# EasyEDA Pro project Source_Boat-Board.epro, schematic pi
Board Name: PCB13; Create Date: 2026-05-29; Page Name: P1; Project Name: fallout; Schematic Name: pi; Update Date: 2026-06-06; Company: EasyEDA.com; Page Size: A4; Version: V1.0
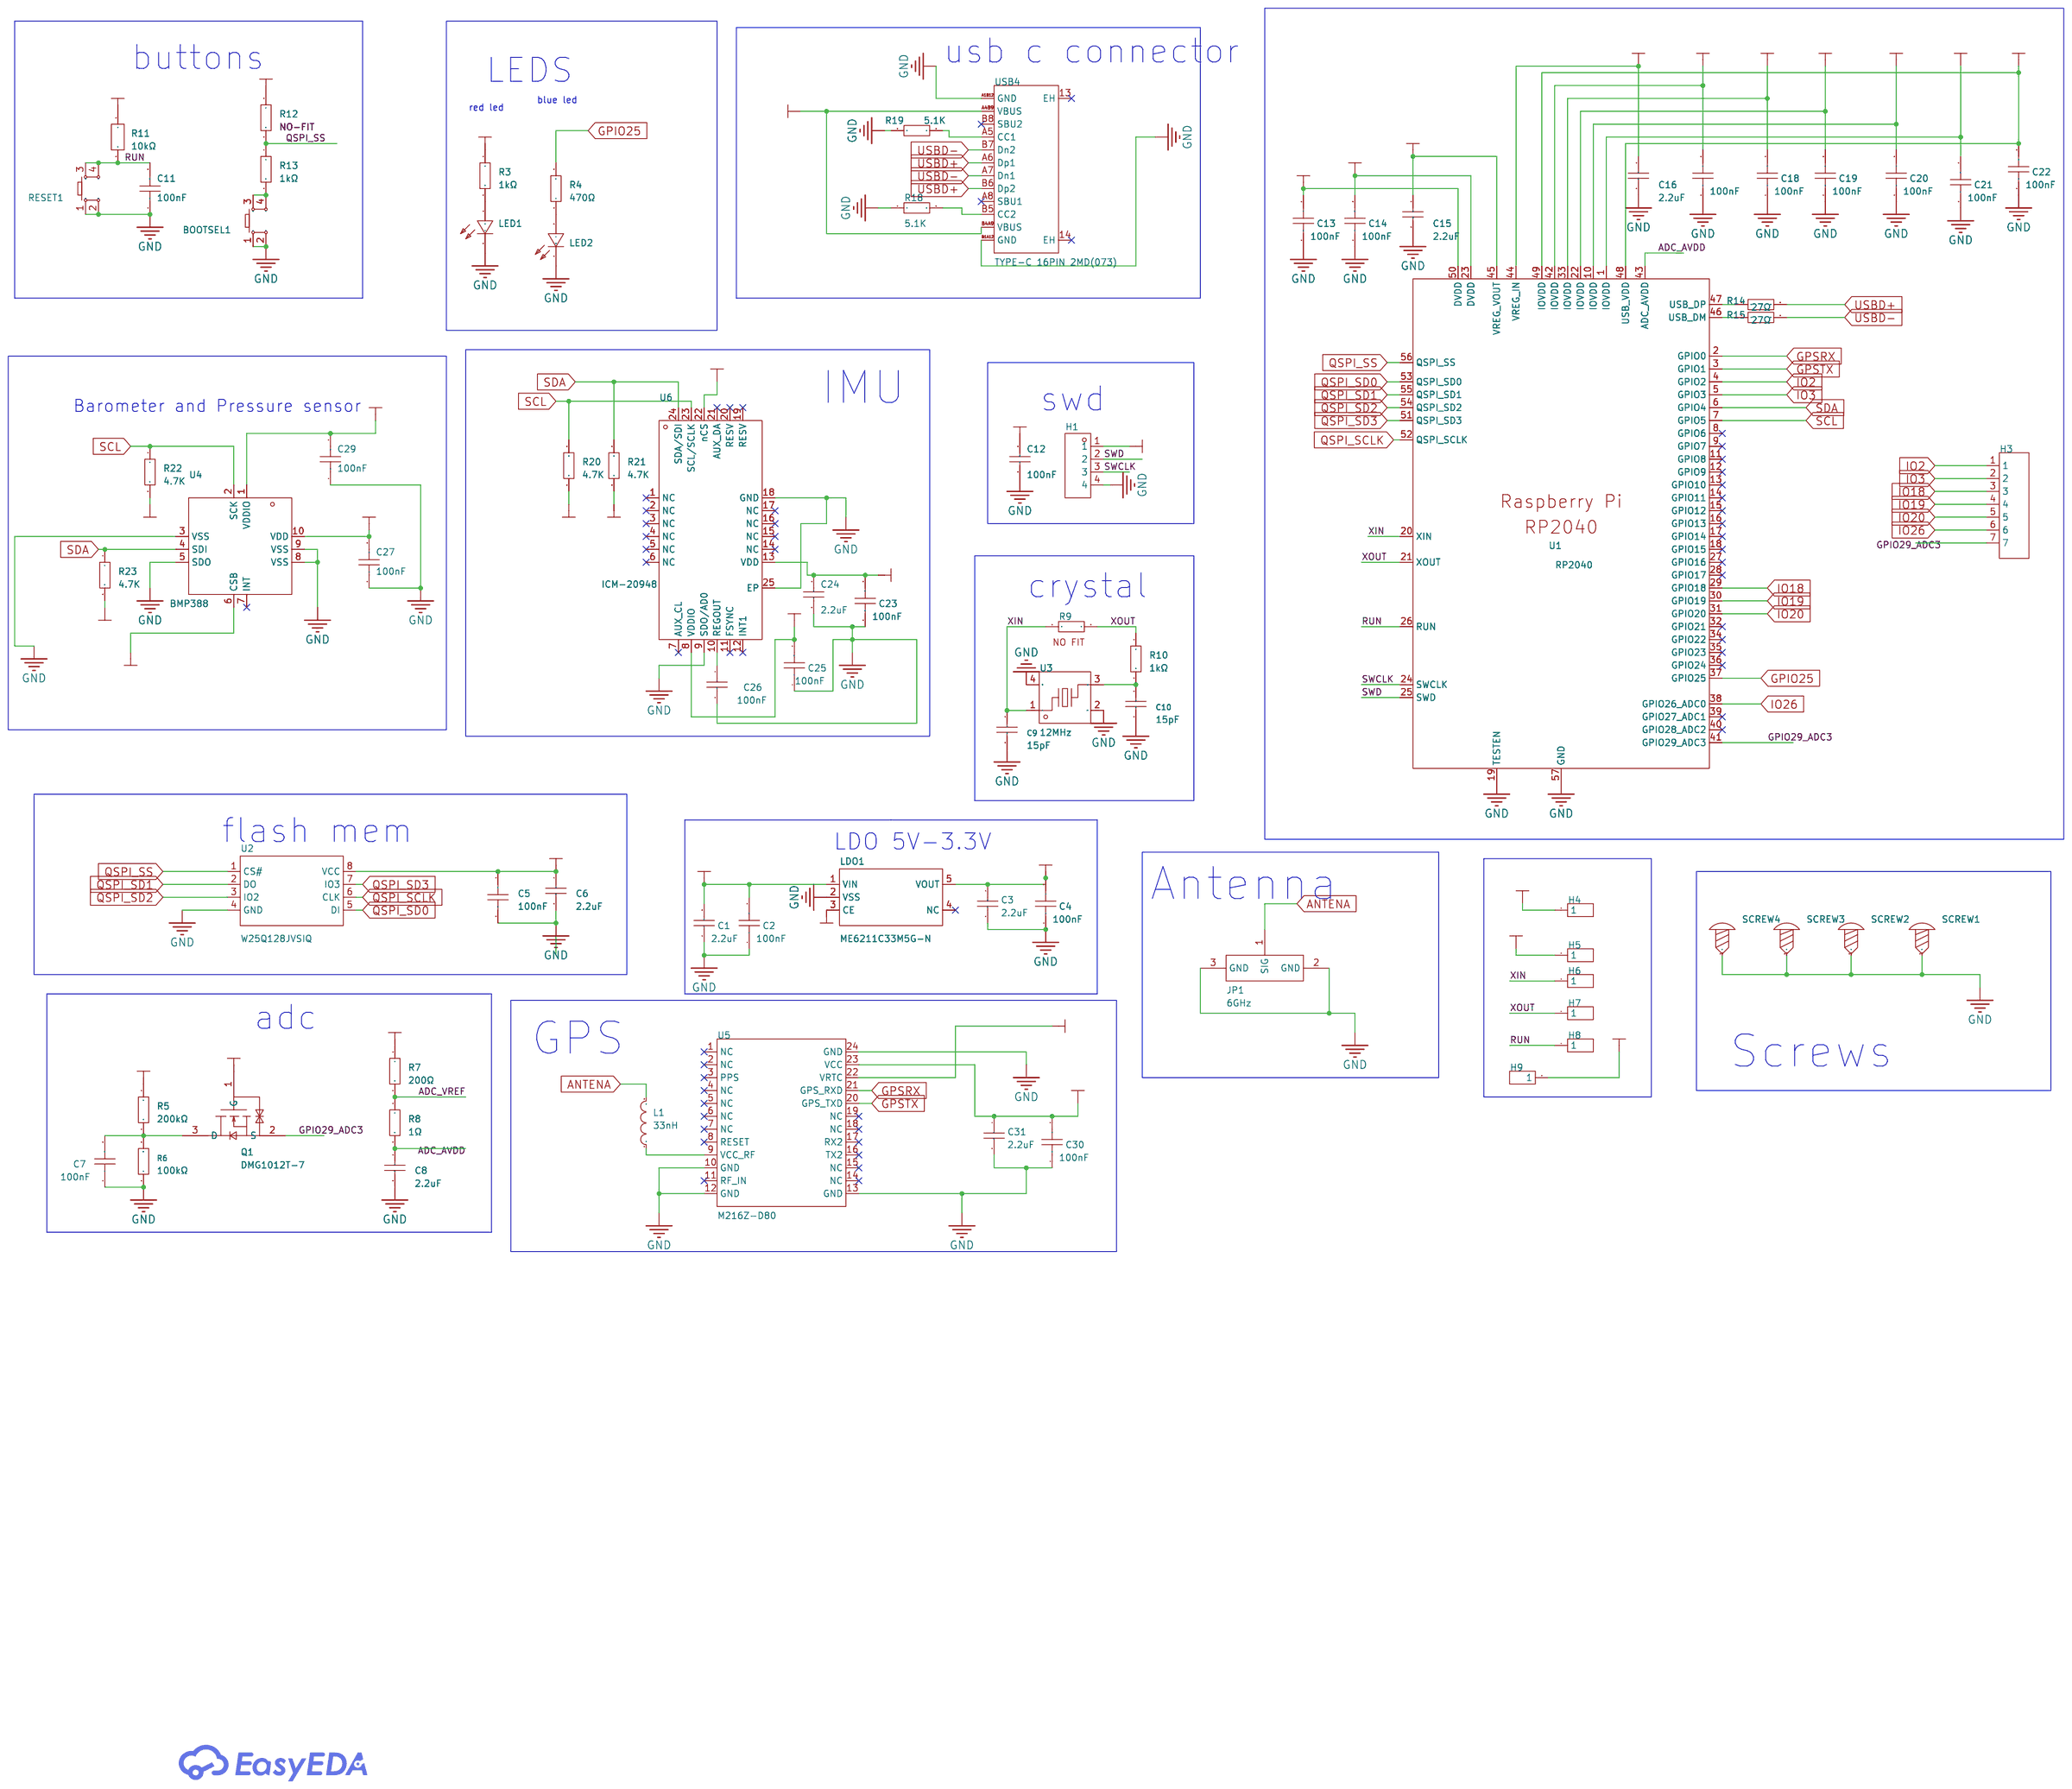
[diagram p0: schematic sheet]

## Parts
BOOTSEL1  PTS815SJK250SMTRLFS  [SW-SMD_4P-L4.2-W3.3-P2.15-LS5.1]
C1  2.2uF  [C0603]
C2  100nF  [C0603]
C3  2.2uF  [C0603]
C4  100nF  [C0603]
C5  100nF  [C0603]
C6  2.2uF  [C0603]
C7  100nF  [C0603]
C8  2.2uF  [C0603]
C9  15pF  [C0603]
C10  15pF  [C0603]
C11  100nF  [C0603]
C12  100nF  [C0603]
C13  100nF  [C0603]
C14  100nF  [C0603]
C15  2.2uF  [C0603]
C16  2.2uF  [C0603]
C17  100nF  [C0603]
C18  100nF  [C0603]
C19  100nF  [C0603]
C20  100nF  [C0603]
C21  100nF  [C0603]
C22  100nF  [C0603]
C23  100nF  [C0603]
C24  2.2uF  [C0603]
C25  100nF  [C0603]
C26  100nF  [C0603]
C27  100nF  [C0603]
C29  100nF  [C0603]
C30  100nF  [C0603]
C31  2.2uF  [C0603]
H1  DZ254W-11-04-65  [HDR-TH_4P-P2.54-H-M-W10.3]
H3  -  [HDR-TH_7P-P2.54-V-F]
H4  -  [HDR-TH_1P-V-M_XKB_X4611WV-01I-C28D40]
H5  -  [HDR-TH_1P-V-M_XKB_X4611WV-01I-C28D40]
H6  -  [HDR-TH_1P-V-M_XKB_X4611WV-01I-C28D40]
H7  -  [HDR-TH_1P-V-M_XKB_X4611WV-01I-C28D40]
H8  -  [HDR-TH_1P-V-M_XKB_X4611WV-01I-C28D40]
H9  -  [HDR-TH_1P-V-M_XKB_X4611WV-01I-C28D40]
JP1  6GHz  [RF-SMD_FRF05002-JSS103M]
L1  33nH  [L0603]
LDO1  ME6211C33M5G-N  [SOT-23-5_L3.0-W1.7-P0.95-LS2.8-BL]
LED1  NCD0603R1  [LED0603-RD_RED]
LED2  19-217/BHC-ZL1M2RY/3T  [LED0603-FD_BLUE]
Q1  DMG1012T-7  [SOT-523-3_L1.6-W0.8-P1.00-LS1.6-BR]
R3  1kΩ  [R0603]
R4  470Ω  [R0603]
R5  200kΩ  [R0603]
R6  100kΩ  [R0603]
R7  200Ω  [R0603]
R8  1Ω  [R0603]
R9  NO FIT  [R0603]
R10  1kΩ  [R0603]
R11  10kΩ  [R0603]
R12  NO-FIT  [R0603]
R13  1kΩ  [R0603]
R14  27Ω  [R0603]
R15  27Ω  [R0603]
R18  5.1K  [R0603]
R19  5.1K  [R0603]
R20  4.7K  [R0603]
R21  4.7K  [R0603]
R22  4.7K  [R0603]
R23  4.7K  [R0603]
RESET1  PTS815SJK250SMTRLFS  [SW-SMD_4P-L4.2-W3.3-P2.15-LS5.1]
SCREW1  -  [Screw-Hole-M2]
SCREW2  -  [Screw-Hole-M2]
SCREW3  -  [Screw-Hole-M2]
SCREW4  -  [Screw-Hole-M2]
U1  RP2040  [LQFN-56_L7.0-W7.0-P0.4-EP]
U2  W25Q128JVSIQ  [SOIC-8_L5.3-W5.3-P1.27-LS8.0-BL]
U3  12MHz  [CRYSTAL-SMD_4P-L3.2-W2.5-BL]
U4  BMP388  [SENSORM-SMD_BMP388]
U5  M216Z-D80  [LCC-24_L16.3-W12.2_NEO-NEO-M10]
U6  ICM-20948  [QFN-24_L3.0-W3.0-P0.40-BL-EP]
USB4  TYPE-C 16PIN 2MD(073)  [USB-C-SMD_TYPE-C-16PIN-2MD-073]

## Library data of the parts
BOOTSEL1 RESET1 = PTS815SJK250SMTRLFS: 操作寿命10万次，使用温度-20°C 至 70°C,尺寸4.20mmx3.20mmx2.50mm，操作力度2.5N; LCSC Part Name: 轻触开关; Supplier Part: C918859; Manufacturer: C&K; Supplier Footprint: SMD; JLCPCB Part Class: 扩展库; Datasheet: https://atta.szlcsc.com/upload/public/pdf/source/20190916/C411883_4F77F16E1D8E48DC707D8949CEE7CF80.pdf; Supplier: LCSC
C1 C3 C6 C8 C15 C16 C24 C31 = CL10A225KO8NNNC: Capacitance:2.2uF Tolerance:±10% Tolerance:±10% Voltage Rating:16V Temperature Coefficient:X5R; LCSC Part Name: 2.2uF ±10% 16V; Supplier Part: C23630; Manufacturer: SAMSUNG(三星); Supplier Footprint: 0603; JLCPCB Part Class: Basic Part; Datasheet: https://item.szlcsc.com/datasheet/CL10A225KO8NNNC/24366.html; Supplier: LCSC; Tolerance: ±10%; Voltage Rating: 16V; Temperature Coefficient: X5R
C2 C4 C11 C13 C14 C17-C23 C25 C27 C29 C30 = 0603B104K500AT: Capacitance:100nF Tolerance:±10% Tolerance:±10% Voltage Rating:50V Temperature Coefficient:X7R; LCSC Part Name: 100nF ±10% 50V; Supplier Part: C191538; Manufacturer: FH(风华); Supplier Footprint: 0603; Datasheet: https://item.szlcsc.com/datasheet/0603B104K500AT/216930.html; Supplier: LCSC; Tolerance: ±10%; Voltage Rating: 50V; Temperature Coefficient: X7R
C5 C7 = CC0603KRX7R9BB104: Capacitance:100nF Tolerance:±10% Tolerance:±10% Voltage Rating:50V Temperature Coefficient:X7R; LCSC Part Name: 100nF ±10% 50V; Supplier Part: C14663; Manufacturer: YAGEO(国巨); Supplier Footprint: 0603; JLCPCB Part Class: Basic Part; Datasheet: https://item.szlcsc.com/datasheet/CC0603KRX7R9BB104/15331.html; Supplier: LCSC; Tolerance: ±10%; Voltage Rating: 50V; Temperature Coefficient: X7R
C9 C10 = CC0603JRNPO9BN150: Capacitance:15pF Tolerance:±5% Tolerance:±5% Voltage Rating:50V Temperature Coefficient:NP0; LCSC Part Name: 15pF ±5% 50V; Supplier Part: C107037; Manufacturer: YAGEO(国巨); Supplier Footprint: 0603; Datasheet: https://item.szlcsc.com/datasheet/CC0603JRNPO9BN150/108253.html; Supplier: LCSC; Tolerance: ±5%; Voltage Rating: 50V; Temperature Coefficient: NP0
C12 C26 = 0603B104K500NT_C30926: Capacitance:100nF Tolerance:±10% Tolerance:±10% Voltage Rating:50V Temperature Coefficient:X7R; LCSC Part Name: 100nF ±10% 50V; Supplier Part: C30926; Manufacturer: FH(风华); Manufacturer Part: 0603B104K500NT; Supplier Footprint: 0603; Datasheet: https://item.szlcsc.com/datasheet/0603B104K500NT/31683.html; Supplier: LCSC; Tolerance: ±10%; Voltage Rating: 50V; Temperature Coefficient: X7R
H1 = DZ254W-11-04-65: 间距:2.54mm;总PIN位数:4;排数:1;插针结构:1x4P;行距:-;安装类型:弯插;圆针/方针:方针;额定电流:3A;额定电压:-;配合针长度:6mm;塑高:2.54mm;端接针长度:-;工作温度范围:-;颜色:-;; LCSC Part Name: 2.54mm 1x4P 弯插 方针; Supplier Part: C2935929; Manufacturer: DEALON(德艺隆); Supplier Footprint: 弯插,P=2.54mm; JLCPCB Part Class: 扩展库; Datasheet: https://atta.szlcsc.com/upload/public/pdf/source/20211231/CEC96EEC99F3217E207F74B399519373.pdf; Supplier: LCSC; Pitch: 2.54mm; Number of Pins: 4; Number of Rows: 1; Pin Structure: 1x4P; Mounting Type: 弯插; Circluar Pins/Square Pins: 方针; Current Rating (Max): 3A; Length of Mating Pin: 6mm; Insulation Height: 2.54mm
H3 = HDR-F_2.54_1x7P: Supplier Footprint: Through
H4-H9 = HDR-M_2.54_1x1P: Supplier Footprint: Through
JP1 = U.FL-R-SMT-1(80)_C88374: Connector Type:Board Side Interface:Male Pin Number of Ports:1 Interface Diameter:2mm Interface Length/Height:1.25mm Frequency:6GHz RF Series:IPEX Impedance:50Ω Style:- Operating Temperature Range:-40℃~+90℃ Operating Temperature Range:-40℃~+90℃; LCSC Part Name: IPEX 内针; Supplier Part: C88374; Manufacturer: HRS(广濑); Manufacturer Part: U.FL-R-SMT-1(80); Supplier Footprint: SMD; JLCPCB Part Class: Extended Part; Datasheet: https://item.szlcsc.com/datasheet/U.FL-R-SMT-1(80)/89553.html; Supplier: LCSC; Connector Type: Board Side; Interface: Male Pin; Number of Ports: 1; Interface Diameter: 2mm; Interface Length/Height: 1.25mm; RF Series: IPEX; Impedance: 50Ω; Operating Temperature Range: -40℃~+90℃
L1 = L_0603
LDO1 = ME6211C33M5G-N: Output Type:Fixed Voltage - Supply:6V Output Voltage:3.3V Output Voltage:3.3V Output Current:500mA Power Supply Rejection Ratio (PSRR):70dB@(1kHz) Voltage Dropout:120mV@(100mA) standby current:60uA Noise:50uVrms Features:Over Current Protection；Enable；Sho; LCSC Part Name: 输入6V 输出3.3V 500mA; Supplier Part: C82942; Manufacturer: MICRONE(南京微盟); Supplier Footprint: SOT-23-5; Datasheet: https://item.szlcsc.com/datasheet/ME6211C33M5G-N/84106.html; Supplier: LCSC; Output Type: Fixed; Voltage - Supply: 6V; Output Voltage: 3.3V; Output Current: 500mA; Power Supply Rejection Ratio (PSRR): 70dB@(1kHz); Voltage Dropout: 120mV@(100mA); standby current: 60uA; Noise: 50uVrms; Features: Over Current Protection；Enable；Short Circuit Protection; Operating Temperature: -40℃~+150℃; Output Configuration: Positive; Number of Outputs: 1
LED1 = NCD0603R1_C84263: Lamp Holder Type:- Illumination Color:Red Voltage - Forward(Vf):1.6V~2.6V Voltage - Forward(Vf):1.6V~2.6V Power(Watts):65mW Forward Current:25mA Wavelength - Dominant:615nm~630nm Wavelength - Dominant:615nm~630nm Peak Wavelength:630nm Diode Configuration:; LCSC Part Name: 片式发光二极管; Supplier Part: C84263; Manufacturer: 国星光电; Supplier Footprint: 0603; JLCPCB Part Class: Extended Part; Datasheet: https://item.szlcsc.com/datasheet/NCD0603R1/85432.html; Supplier: LCSC; Illumination Color: Red; Voltage - Forward(Vf): 1.6V~2.6V; Power(Watts): 65mW; Forward Current: 25mA; Wavelength - Dominant: 615nm~630nm; Peak Wavelength: 630nm; Diode Configuration: Discrete Diode; Luminous Intensity: 220mcd; Viewing Angle: 130°; Operating Temperature: -30℃~+85℃
LED2 = 19-217/BHC-ZL1M2RY/3T: Lamp Holder Type:- Illumination Color:Blue Voltage - Forward(Vf):2.8V Voltage - Forward(Vf):2.8V Power(Watts):110mW Forward Current:5mA Wavelength - Dominant:465nm~475nm Wavelength - Dominant:465nm~475nm Peak Wavelength:468nm Diode Configuration:Discrete; LCSC Part Name: 蓝灯 停产; Supplier Part: C72041; Manufacturer: EVERLIGHT(亿光); Supplier Footprint: 0603; JLCPCB Part Class: Extended Part; Datasheet: https://en.everlight.com/wp-content/plugins/ItemRelationship/product_files/pdf/19-217-BHC-ZL1M2RY-3T.pdf; Supplier: LCSC; Illumination Color: Blue; Voltage - Forward(Vf): 2.8V; Power(Watts): 110mW; Forward Current: 5mA; Wavelength - Dominant: 465nm~475nm; Peak Wavelength: 468nm; Diode Configuration: Discrete Diode; Lens Color: Water Clear; Luminous Intensity: 24.5mcd~28.5mcd; Viewing Angle: 120°; Operating Temperature: -40℃~+85℃
Q1 = DMG1012T-7: Number:1 N-Channel Drain to Source Voltage:20V Current - Continuous Drain(Id):630mA RDS(on):300mΩ@4.5V；400mΩ@2.5V；500mΩ@1.8V Pd - Power Dissipation:280mW Gate Threshold Voltage (Vgs(th)):1V@250uA Gate Charge(Qg):736.6pC@4.5V Input Capacitance(Ciss):60.67p; LCSC Part Name: 1个N沟道 耐压:20V 电流:630mA; Supplier Part: C20512; Manufacturer: DIODES(美台); Supplier Footprint: SOT-523; JLCPCB Part Class: Extended Part; Datasheet: https://item.szlcsc.com/datasheet/DMG1012T-7/21223.html; Supplier: LCSC; Number: 1 N-Channel; Drain to Source Voltage: 20V; Current - Continuous Drain(Id): 630mA; RDS(on): 300mΩ@4.5V；400mΩ@2.5V；500mΩ@1.8V; Pd - Power Dissipation: 280mW; Gate Threshold Voltage (Vgs(th)): 1V@250uA; Gate Charge(Qg): 736.6pC@4.5V; Input Capacitance(Ciss): 60.67pF; Reverse Transfer Capacitance (Crss@Vds): 5.37pF; Operating Temperature: -55℃~+150℃; Output Capacitance(Coss): 9.68pF
R3 R10 R13 = RC0603FR-071KL: Type:Thick Film Resistor Resistance:1kΩ Tolerance:±1% Tolerance:±1% Power(Watts):100mW Voltage-Supply(Max):75V Temperature Coefficient:±100ppm/℃ Temperature Coefficient:±100ppm/℃ Operating Temperature:-55℃~+155℃ Operating Temperature:-55℃~+155℃; LCSC Part Name: 厚膜电阻 1kΩ ±1% 100mW; Supplier Part: C22548; Manufacturer: YAGEO(国巨); Supplier Footprint: 0603; JLCPCB Part Class: Extended Part; Datasheet: https://item.szlcsc.com/datasheet/RC0603FR-071KL/23274.html; Supplier: LCSC; Type: Thick Film Resistor; Tolerance: ±1%; Power(Watts): 100mW; Voltage-Supply(Max): 75V; Temperature Coefficient: ±100ppm/℃; Operating Temperature: -55℃~+155℃
R4 = RC0603FR-07470RL: Type:Thick Film Resistors Resistance: Tolerance:±1% Tolerance:±1% Power(Watts): Overload Voltage (Max): Temperature Coefficient:±100ppm/℃ Temperature Coefficient:±100ppm/℃ Operating Temperature Range:-55℃~+155℃ Operating Temperature Range:-55℃~+155℃; LCSC Part Name: 厚膜电阻 470Ω ±1% 100mW; Supplier Part: C114669; Manufacturer: YAGEO(国巨); Supplier Footprint: 0603; JLCPCB Part Class: Extended Part; Datasheet: https://atta.szlcsc.com/upload/public/pdf/source/20180821/C275644_0D56F95EFF785E7D9A1FEF436B37DA78.pdf; Supplier: LCSC; Type: Thick Film Resistors; Tolerance: ±1%; Temperature Coefficient: ±100ppm/℃; Operating Temperature Range: -55℃~+155℃
R5 = RC0603FR-07200KL: Type:Thick Film Resistors Resistance: Tolerance:±1% Tolerance:±1% Power(Watts): Overload Voltage (Max): Temperature Coefficient:±100ppm/℃ Temperature Coefficient:±100ppm/℃ Operating Temperature Range:-55℃~+155℃ Operating Temperature Range:-55℃~+155℃; LCSC Part Name: 厚膜电阻 200kΩ ±1% 100mW; Supplier Part: C105574; Manufacturer: YAGEO(国巨); Supplier Footprint: 0603; JLCPCB Part Class: Extended Part; Datasheet: https://atta.szlcsc.com/upload/public/pdf/source/20180821/C275644_0D56F95EFF785E7D9A1FEF436B37DA78.pdf; Supplier: LCSC; Type: Thick Film Resistors; Tolerance: ±1%; Temperature Coefficient: ±100ppm/℃; Operating Temperature Range: -55℃~+155℃
R6 = RC0603FR-07100KL: Type:Thick Film Resistors Resistance: Tolerance:±1% Tolerance:±1% Power(Watts): Overload Voltage (Max): Temperature Coefficient:±100ppm/℃ Temperature Coefficient:±100ppm/℃ Operating Temperature Range:-55℃~+155℃ Operating Temperature Range:-55℃~+155℃; LCSC Part Name: 厚膜电阻 100kΩ ±1% 100mW; Supplier Part: C14675; Manufacturer: YAGEO(国巨); Supplier Footprint: 0603; JLCPCB Part Class: Extended Part; Datasheet: https://atta.szlcsc.com/upload/public/pdf/source/20140324/1457707028752.pdf; Supplier: LCSC; Type: Thick Film Resistors; Tolerance: ±1%; Temperature Coefficient: ±100ppm/℃; Operating Temperature Range: -55℃~+155℃
R7 = RC0603FR-07200RL: Type:Thick Film Resistor Resistance:200Ω Tolerance:±1% Tolerance:±1% Power(Watts):100mW Voltage-Supply(Max):75V Temperature Coefficient:±100ppm/℃ Temperature Coefficient:±100ppm/℃ Operating Temperature:-55℃~+155℃ Operating Temperature:-55℃~+155℃; LCSC Part Name: 厚膜电阻 200Ω ±1% 100mW; Supplier Part: C114664; Manufacturer: YAGEO(国巨); Supplier Footprint: 0603; Datasheet: https://item.szlcsc.com/datasheet/RC0603FR-07200RL/115908.html; Supplier: LCSC; Type: Thick Film Resistor; Tolerance: ±1%; Power(Watts): 100mW; Voltage-Supply(Max): 75V; Temperature Coefficient: ±100ppm/℃; Operating Temperature: -55℃~+155℃
R8 = RC0603FR-071RL: Type:Thick Film Resistor Resistance:1Ω Tolerance:±1% Tolerance:±1% Power(Watts):100mW Voltage-Supply(Max):75V Temperature Coefficient:±200ppm/℃ Temperature Coefficient:±200ppm/℃ Operating Temperature:-55℃~+155℃ Operating Temperature:-55℃~+155℃; LCSC Part Name: 厚膜电阻 1Ω ±1% 100mW; Supplier Part: C112305; Manufacturer: YAGEO(国巨); Supplier Footprint: 0603; Datasheet: https://item.szlcsc.com/datasheet/RC0603FR-071RL/113537.html; Supplier: LCSC; Type: Thick Film Resistor; Tolerance: ±1%; Power(Watts): 100mW; Voltage-Supply(Max): 75V; Temperature Coefficient: ±200ppm/℃; Operating Temperature: -55℃~+155℃
R9 R12 R18-R23 = Res_0603: Supplier Footprint: 0603
R11 = NQ03WAF1002T5E: Type:Thick Film Resistor Resistance:10kΩ Tolerance:±1% Tolerance:±1% Power(Watts):100mW Voltage-Supply(Max):75V Temperature Coefficient:±100ppm/℃ Temperature Coefficient:±100ppm/℃ Operating Temperature:-55℃~+155℃ Operating Temperature:-55℃~+155℃; LCSC Part Name: 厚膜电阻 10kΩ ±1% 100mW 抗硫化汽车级晶片电阻器; Supplier Part: C965184; Manufacturer: UNI-ROYAL(厚声); Supplier Footprint: 0603; JLCPCB Part Class: Extended Part; Datasheet: https://item.szlcsc.com/datasheet/NQ03WAF1002T5E/1050316.html; Supplier: LCSC; Type: Thick Film Resistor; Tolerance: ±1%; Power(Watts): 100mW; Voltage-Supply(Max): 75V; Temperature Coefficient: ±100ppm/℃; Operating Temperature: -55℃~+155℃
R14 R15 = 0603WAF270JT5E: 电阻类型:厚膜电阻;阻值:27Ω;精度:±1%;功率:100mW;温度系数:±200ppm/℃;最大工作电压:75V;工作温度范围:-55℃~+155℃;; LCSC Part Name: 27Ω ±1% 100mW; Supplier Part: C25190; Manufacturer: UNI-ROYAL(厚声); Supplier Footprint: 0603; Datasheet: https://atta.szlcsc.com/upload/public/pdf/source/20200306/C422600_1E6D84923E4A46A82E41ADD87F860B5C.pdf; Supplier: LCSC; Type: 厚膜电阻; Tolerance: ±1%; Power(Watts): 100mW; Temperature Coefficient: ±200ppm/℃; Overload Voltage (Max): 75V; Operating Temperature Range: -55℃~+155℃
SCREW1-SCREW4 = Screw-Hole-M2: Supplier Footprint: 插件
U1 = RP2040_C2040: CPU Core:- CPU Maximum Speed:133MHz Number of I/O:30 ADC (Bit):12bit; LCSC Part Name: RP2040（RP2B2）; Supplier Part: C2040; Manufacturer: Raspberry Pi(树莓派); Supplier Footprint: LQFN-56(7x7); JLCPCB Part Class: Extended Part; Datasheet: https://item.szlcsc.com/datasheet/RP2040/2392.html; Supplier: LCSC; CPU Maximum Speed: 133MHz; Number of I/O: 30; ADC (Bit): 12bit
U2 = W25Q128JVSIQ: Interface:SPI Memory Size:128Mbit Clock Frequency:133MHz Voltage - Supply:2.7V~3.6V Voltage - Supply:2.7V~3.6V Standby Supply Current:1uA Program / Erase Cycles:100,000 Cycles Page Programming Time (Tpp):3ms Block Erase Time(tBE):120ms@(32KB) Data Retenti; LCSC Part Name: 编带 支持双路/四路SPI接口的3V、128Mbit 串行闪存; Supplier Part: C97521; Manufacturer: Winbond(华邦); Supplier Footprint: SOIC-8-208mil; JLCPCB Part Class: Basic Part; Datasheet: https://item.szlcsc.com/datasheet/W25Q128JVSIQ/98729.html; Supplier: LCSC; Interface: SPI; Memory Size: 128Mbit; Clock Frequency: 133MHz; Voltage - Supply: 2.7V~3.6V; Standby Supply Current: 1uA; Program / Erase Cycles: 100,000 Cycles; Page Programming Time (Tpp): 3ms; Block Erase Time(tBE): 120ms@(32KB); Data Retention - TDR (Year): 20 Years; Operating Temperature: -40℃~+85℃
U3 = 0132M412000F10FTNNL: Type:Crystal Oscillator Frequency:12MHz Normal temperature Frequency Tolerance:±10ppm Normal temperature Frequency Tolerance:±10ppm Load Capacitance:10pF Frequency Stability:±10ppm Frequency Stability:±10ppm Equivalent Series Resistance(ESR):100Ω Operatin; LCSC Part Name: 3225 4P 12MHz 10pF ±10ppm -30℃~+85℃(±10ppm); Supplier Part: C5288803; Manufacturer: HCI(杭晶); Supplier Footprint: SMD3225-4P; JLCPCB Part Class: Extended Part; Datasheet: https://item.szlcsc.com/datasheet/0132M412000F10FTNNL/6026582.html; Supplier: LCSC; Type: Crystal Oscillator; Normal temperature Frequency Tolerance: ±10ppm; Load Capacitance: 10pF; Frequency Stability: ±10ppm; Equivalent Series Resistance(ESR): 100Ω; Operating Temperature: -30℃~+85℃
U4 = BMP388: Pressure range:30Kpa~1.25bar Pressure range:30Kpa~1.25bar Voltage - Supply:1.65V~3.6V Voltage - Supply:1.65V~3.6V Standby Current:2uA Interface:SPI；I2C Module:- Absolute Accuracy:50pa Relative Accuracy:8pa Features:Standby mode；On-chip temperature output；; LCSC Part Name: 数字压力传感器; Supplier Part: C779278; Manufacturer: Bosch(博世); Supplier Footprint: LGA-10(2x2); JLCPCB Part Class: Extended Part; Datasheet: https://item.szlcsc.com/datasheet/BMP388/828796.html; Supplier: LCSC; Pressure range: 30Kpa~1.25bar; Voltage - Supply: 1.65V~3.6V; Standby Current: 2uA; Interface: SPI；I2C; Absolute Accuracy: 50pa; Relative Accuracy: 8pa; Features: Standby mode；On-chip temperature output；Integrated ADC and digital interface; Temperature Coefficient of Offset(TCO): 1pa/K; Operating Temperature: -40℃~+85℃
U5 = M216Z-D80: GNSS Type:QZSS；GLONASS；BDS；GALILEO；GPS Voltage - Supply:1.8V~3.3V Voltage - Supply:1.8V~3.3V Current - Supply:35mA@3.3V Sensitivity:-148dBm Sensitivity:-148dBm Accuracy:1m Time To First Fix:25s Features:Hot start acceleration；Dual-band / multi-band positi; LCSC Part Name: 全系统双频卫星定位模组; Supplier Part: C49286686; Manufacturer: 如般微; Supplier Footprint: LCC-24(12.2x16); JLCPCB Part Class: Extended Part; Datasheet: https://item.szlcsc.com/datasheet/M216Z-D80/51736445.html; Supplier: LCSC; GNSS Type: QZSS；GLONASS；BDS；GALILEO；GPS; Voltage - Supply: 1.8V~3.3V; Current - Supply: 35mA@3.3V; Sensitivity: -148dBm; Accuracy: 1m; Time To First Fix: 25s; Features: Hot start acceleration；Dual-band / multi-band positioning；RTC backup power
U6 = ICM-20948: Accelerometer Sensing Axis:X,Y,Z Acceleration Measurement Range (MAX):±16g Acceleration Measurement Range (MAX):±16g Gyroscope Sensing Axis:X,Y,Z Gyroscope Measurement Range (MAX):±2000dps Gyroscope Measurement Range (MAX):±2000dps Sensor Type:IMU (accele; LCSC Part Name: 九轴MEMS运动追踪器件; Supplier Part: C726001; Manufacturer: TDK InvenSense(应美盛); Supplier Footprint: QFN-24(3x3); JLCPCB Part Class: Extended Part; Datasheet: https://item.szlcsc.com/datasheet/ICM-20948/772651.html; Supplier: LCSC; Accelerometer Sensing Axis: X,Y,Z; Acceleration Measurement Range (MAX): ±16g; Gyroscope Sensing Axis: X,Y,Z; Gyroscope Measurement Range (MAX): ±2000dps; Sensor Type: IMU (accelerometer + gyroscope); Output Bits: 16bit; Interface: I2C；SPI; Voltage - Supply: 1.71V~3.6V; Cache Size: 0.5KB; Standby Current: 8uA; Operating Temperature: -40℃~+85℃
USB4 = TYPE-C 16PIN 2MD(073): Connector Type:Type-C Protocol Standard:- Gender:Female Mounting Type:Surface Mount, Right Angle Number of Contacts:16P Number of Ports:1 Current Rating-Power:3A Voltage Rating:5V Connect-Disconnect Life:10,000 Cycles Supplementary Features:- Center Heigh; LCSC Part Name: Type-C 母 卧贴; Supplier Part: C2765186; Manufacturer: SHOU HAN(首韩); Supplier Footprint: SMD; JLCPCB Part Class: Extended Part; Datasheet: https://item.szlcsc.com/datasheet/TYPE-C%252016PIN%25202MD(073)/2901843.html; Supplier: LCSC; Connector Type: Type-C; Gender: Female; Mounting Type: Surface Mount, Right Angle; Number of Contacts: 16P; Number of Ports: 1; Current Rating-Power: 3A; Voltage Rating: 5V; Connect-Disconnect Life: 10,000 Cycles; Detection color: Black; Operating Temperature: -25℃~+85℃

## Nets
1V1: C13.2 C14.2 C15.1 H5.1 U1.23(DVDD) U1.45(VREG_VOUT) U1.50(DVDD)
3V3: C3.1 C4.2 C5.1 C6.1 C12.1 C16.1 C17.2 C18.2 C19.2 C20.2 C21.2 C22.2 C23.2 C24.1 C25.2 C27.2 C29.2 C30.2 C31.1 H1.1 H4.1 LDO1.5(VOUT) Q1.1(G) R3.1 R7.1 R11.1 R12.1 R20.2 R21.2 R22.2 R23.2 U1.1(IOVDD) U1.10(IOVDD) U1.22(IOVDD) U1.33(IOVDD) U1.42(IOVDD) U1.44(VREG_IN) U1.48(USB_VDD) U1.49(IOVDD) U2.8(VCC) U4.1(VDDIO) U4.6(CSB) U4.10(VDD) U5.22(VRTC) U5.23(VCC) U6.8(VDDIO) U6.13(VDD) U6.22(nCS)
GND: BOOTSEL1.1 BOOTSEL1.2 C1.1 C2.1 C3.2 C4.1 C5.2 C6.2 C7.1 C8.2 C9.1 C10.1 C11.1 C12.2 C13.1 C14.1 C15.2 C16.2 C17.1 C18.1 C19.1 C20.1 C21.1 C22.1 C23.1 C24.2 C25.1 C26.2 C27.1 C29.1 C30.1 C31.2 H1.4 JP1.2(GND) JP1.3(GND) LDO1.2(VSS) LED1.1(K) LED2.1(C) R6.1 R18.1 R19.1 RESET1.1 RESET1.2 SCREW1.1 SCREW2.1 SCREW3.1 SCREW4.1 U1.19(TESTEN) U1.57(GND) U2.4(GND) U3.2(GND) U3.4(GND) U4.3(VSS) U4.5(SDO) U4.8(VSS) U4.9(VSS) U5.10(GND) U5.12(GND) U5.13(GND) U5.24(GND) U6.9(SDO/AD0) U6.18(GND) U6.25(EP) USB4.A1B12(GND) USB4.B1A12(GND)
VBUS: USB4.A4B9(VBUS) USB4.B4A9(VBUS)
ADC_AVDD: C8.1 R8.2 U1.43(ADC_AVDD)
ADC_VREF: R7.2 R8.1
ANTENA: JP1.1(SIG) L1.2
GPIO25: R4.2 U1.37(GPIO25)
GPIO29_ADC3: H3.7 Q1.2(S) U1.41(GPIO29_ADC3)
GPSRX: U1.2(GPIO0) U5.21(GPS_RXD)
GPSTX: U1.3(GPIO1) U5.20(GPS_TXD)
IO2: H3.1 U1.4(GPIO2)
IO3: H3.2 U1.5(GPIO3)
IO18: H3.3 U1.29(GPIO18)
IO19: H3.4 U1.30(GPIO19)
IO20: H3.5 U1.31(GPIO20)
IO26: H3.6 U1.38(GPIO26_ADC0)
QSPI_SCLK: U1.52(QSPI_SCLK) U2.6(CLK)
QSPI_SD0: U1.53(QSPI_SD0) U2.5(DI)
QSPI_SD1: U1.55(QSPI_SD1) U2.2(DO)
QSPI_SD2: U1.54(QSPI_SD2) U2.3(IO2)
QSPI_SD3: U1.51(QSPI_SD3) U2.7(IO3)
QSPI_SS: R12.2 R13.1 U1.56(QSPI_SS) U2.1(CS#)
RUN: C11.2 H8.1 R11.2 RESET1.3 RESET1.4 U1.26(RUN)
SCL: R20.1 R22.1 U1.7(GPIO5) U4.2(SCK) U6.23(SCL/SCLK)
SDA: R21.1 R23.1 U1.6(GPIO4) U4.4(SDI) U6.24(SDA/SDI)
SWCLK: H1.3 U1.24(SWCLK)
SWD: H1.2 U1.25(SWD)
USBD+: R14.2 USB4.A6(Dp1) USB4.B6(Dp2)
USBD-: R15.2 USB4.A7(Dn1) USB4.B7(Dn2)
VSYS: C1.2 C2.2 H9.1 LDO1.1(VIN) LDO1.3(CE) R5.1
XIN: C9.2 H6.1 R9.1 U1.20(XIN) U3.1
XOUT: H7.1 R9.2 R10.1 U1.21(XOUT)
$1N19406: LED1.2(A) R3.2
$1N19408: LED2.2(A) R4.1
$1N19463: BOOTSEL1.3 BOOTSEL1.4 R13.2
$1N19510: R14.1 U1.47(USB_DP)
$1N19539: R15.1 U1.46(USB_DM)
$1N19579: C10.2 R10.2 U3.3
$1N19631: C7.2 Q1.3(D) R5.2 R6.2
$1N20843: R19.2 USB4.A5(CC1)
$1N20865: R18.2 USB4.B5(CC2)
$1N24212: C26.1 U6.10(REGOUT)
$1N25598: L1.1 U5.9(VCC_RF)

Not connected (* = marked no-connect by the designer): LDO1 4(NC)*; U1 8(GPIO6)* 9(GPIO7)* 11(GPIO8)* 12(GPIO9)* 13(GPIO10)* 14(GPIO11)* 15(GPIO12)* 16(GPIO13)* 17(GPIO14)* 18(GPIO15)* 27(GPIO16)* 28(GPIO17)* 32(GPIO21)* 34(GPIO22)* 35(GPIO23)* 36(GPIO24)* 39(GPIO27_ADC1)* 40(GPIO28_ADC2)*; U4 7(INT)*; U5 1(NC)* 2(NC)* 3(PPS)* 4(NC)* 5(NC)* 6(NC)* 7(NC)* 8(RESET)* 11(RF_IN)* 14(NC)* 15(NC)* 16(TX2)* 17(RX2)* 18(NC)* 19(NC)*; U6 1(NC)* 2(NC)* 3(NC)* 4(NC)* 5(NC)* 6(NC)* 7(AUX_CL)* 11(FSYNC)* 12(INT1)* 14(NC)* 15(NC)* 16(NC)* 17(NC)* 19(RESV)* 20(RESV)* 21(AUX_DA)*; USB4 13(EH)* 14(EH)* A8(SBU1)* B8(SBU2)*

## Notes on the sheet
- buttons
- usb c connector
- LEDS
- red led
- blue led
- IMU
- Barometer and Pressure sensor
- swd
- crystal
- flash mem
- LDO 5V-3.3V
- Antenna
- adc
- GPS
- Screws
